# Altium schematic sheet DAC_ADC.SchDoc
size A4; Revision: 1; SheetNumber: 1; SheetTotal: 5
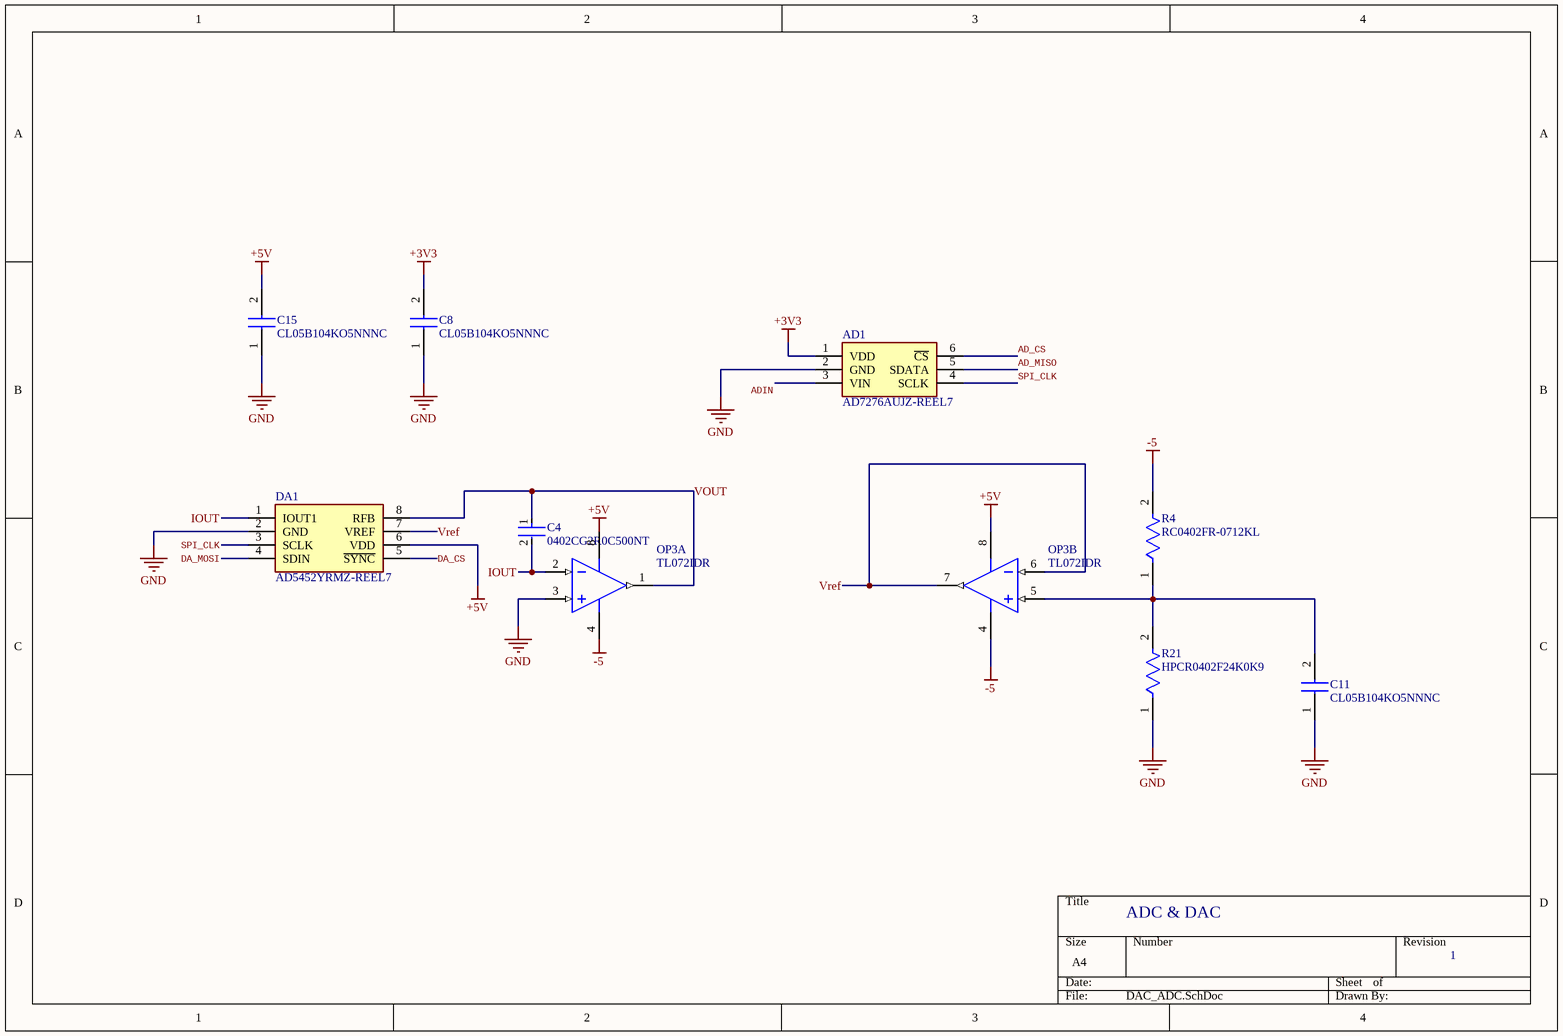
[diagram p0: DAC_ADC.SchDoc]

## Parts
AD1  AD7276AUJZ-REEL7  [SOT95P280X100-6N]
C4  0402CG2R0C500NT  [FP-GJM155-0_05-IPC_C]
C8  CL05B104KO5NNNC  [CAPC1005X55N]
C11  CL05B104KO5NNNC  [CAPC1005X55N]
C15  CL05B104KO5NNNC  [CAPC1005X55N]
DA1  AD5452YRMZ-REEL7  [SOP65P490X110-8N]
OP3  TL072IDR  [D0008A_L]  (parts A,B of 2)
R4  RC0402FR-0712KL  [FP-RC0402-0_4-IPC_C]
R21  HPCR0402F24K0K9  [FP-RT0402-MFG]

## Nets
+3V3: AD1.1(VDD) C8.2
+5V: C15.2 DA1.6(VDD) OP3.8(VCC+)
-5: OP3.4(VCC-) R4.2
GND: AD1.2(GND) C8.1 C11.1 C15.1 DA1.2(GND) OP3.3(IN1+) R21.1
AD_CS: AD1.6(~{CS})
AD_MISO: AD1.5(SDATA)
ADIN: AD1.3(VIN)
DA_CS: DA1.5(~{SYNC})
DA_MOSI: DA1.4(SDIN)
IOUT: C4.2 DA1.1(IOUT1) OP3.2(IN1-)
SPI_CLK: AD1.4(SCLK) DA1.3(SCLK)
VOUT: C4.1 DA1.8(RFB) OP3.1(OUT1)
Vref: DA1.7(VREF) OP3.6(IN2-) OP3.7(OUT2)
NetC11_2: C11.2 OP3.5(IN2+) R4.1 R21.2

## Notes on the sheet
- ADC & DAC
- 1

## Library data of the parts
AD1 = AD7276AUJZ-REEL7: Integrated Circuit; Manufacturer_Name: Analog Devices; Datasheet Link: http://componentsearchengine.com/Datasheets/1/AD7276AUJZ-REEL7.pdf; Height: 1mm; Manufacturer_Part_Number: AD7276AUJZ-REEL7; Mouser Part Number: 584-AD7276AUJZ-R7; Mouser Price/Stock: https://www.mouser.co.uk/ProductDetail/Analog-Devices/AD7276AUJZ-REEL7?qs=NmRFExCfTkGcJMyUALbIIQ%3D%3D; Arrow Part Number: AD7276AUJZ-REEL7; Arrow Price/Stock: https://www.arrow.com/en/products/ad7276aujz-reel7/analog-devices
C4 = CMP-2008-03830-2: Multi-Layer Ceramic Capacitor 2pF C0G  ±0.1pF 0402 Paper T/R; Voltage Rating: 50V; Mount: Surface Mount; REACH SVHC: No SVHC; Lead Pitch: 0.3mm; Length: 1mm; Lead Free: Lead Free; Radiation Hardening: No; Depth: 0.5mm; Thickness: 0.022inch; Number of Pins: 2; Height: 0.5mm; Min Operating Temperature: -55°C; Width: 0.5mm; Packaging: Tape and Reel; Case Code (Metric): 1005; Capacitance: 2pF; Voltage Rating (DC): 50V; Package Quantity: 1; Max Operating Temperature: 125°C; Case/Package: 0402; Case Code (Imperial): 0402; Dielectric: C0G; Termination: SMD/SMT
C8 C11 C15 = CL05B104KO5NNNC: Capacitor; Manufacturer_Name: SAMSUNG; Datasheet Link: https://datasheet.datasheetarchive.com/originals/distributors/Datasheets-DGA10/2408147.pdf; Height: 0.55mm; Manufacturer_Part_Number: CL05B104KO5NNNC; Mouser Part Number: 187-CL05B104KO5NNNC; Mouser Price/Stock: https://www.mouser.co.uk/ProductDetail/Samsung-Electro-Mechanics/CL05B104KO5NNNC?qs=hqM3L16%252BxlfT2SKOuAUq6Q%3D%3D; Arrow Part Number: CL05B104KO5NNNC; Arrow Price/Stock: https://www.arrow.com/en/products/cl05b104ko5nnnc/samsung-electro-mechanics?utm_currency=USD&region=europe
DA1 = AD5452YRMZ-REEL7: Integrated Circuit; Manufacturer_Name: Analog Devices; Datasheet Link: https://componentsearchengine.com/Datasheets/1/AD5452YRMZ-REEL7.pdf; Height: 1.1mm; Manufacturer_Part_Number: AD5452YRMZ-REEL7; Mouser Part Number: 584-AD5452YRMZ-R7; Mouser Price/Stock: https://www.mouser.co.uk/ProductDetail/Analog-Devices/AD5452YRMZ-REEL7?qs=NmRFExCfTkHoityukWLALQ%3D%3D; Arrow Part Number: AD5452YRMZ-REEL7; Arrow Price/Stock: https://www.arrow.com/en/products/ad5452yrmz-reel7/analog-devices?region=nac
OP3 = CMP-0015-00084-2: Dual Low-Noise JFET-Input General-Purpose Operational Amplifier, 7 to 36 V, -40 to 85 degC, 8-pin SOIC (D8), Green (RoHS & no Sb/Br); Manufacturer: Texas Instruments; Number of Channels: 2; Rating: Catalog; IIB(Max)(pA): 200; Total Supply Voltage(Max)(+5V is 5, +/-5V is 10): 36; Vio (25C)(Max)(mV): 6; Iq per channel(Max)(mA): 2.5; Offset Drift(Typ)(uV/C): 18; Total Supply Voltage(Min)(+5V is 5, +/-5V is 10): 7; CMRR(Min)(dB): 75; Slew Rate(Typ)(V/us): 13; Sub Family: General Purpose Amplifier, High Supply Voltage Amplifier (>=30V); GBW(Typ)(MHz): 3; Code_JEDEC: MS-012; Eco-Plan: Green (RoHS & no Sb/Br); Mounting Technology: Surface Mount; ComponentLink3Description: Package Specification; PackageReference: D0008A; ComponentLink2URL: http://www.ti.com/lit/ds/symlink/tl072.pdf; ComponentLink1Description: Manufacturer URL; ComponentLink3URL: http://www.ti.com/litv/pdf/msoi002j; ComponentLink2Description: Datasheet; DatasheetVersion: SLOS080J; ComponentLink1URL: http://www.ti.com/; PackageDescription: 8-Pin Plastic Small Outline, Body 4.9 x 3.9 mm, Pitch 1.27 mm; PackageVersion: 4040047-3/M, 06/2011; Vn at 1kHz(Typ)(nV/rtHz): 18; PartNumber: TL072IDR
R4 = CMP-2002-07378-2: RES SMD 12K OHM 1% 1/16W 0402; Power Rating: 62.5mW; Voltage Rating: 50V; Resistance: 12kR; Max Power Dissipation: 63mW; Temperature Coefficient: 100ppm/°C; Construction: Rectangular; Case Code (Metric): 1005; Package Quantity: 1; Weight: 2.3E-05oz; RoHS Compliant: Yes; Packaging: Tape and Reel; Case Code (Imperial): 0402; Military Standard: Not; Min Operating Temperature: -55°C; Depth: 0.5mm; Length: 1mm; Width: 0.02inch; Termination: SMD/SMT; Lead Free: Lead Free; Tolerance: 1%; REACH SVHC: No SVHC; Size Code: 0402; Resistance Tolerance: 1%; Series: RC; Max Operating Temperature: 155°C; Height: 0.016inch; Features: Moisture Resistant; Number of Terminations: 2; Case/Package: 0402; Resistor Type: Thick Film
R21 = CMP-03412-008661-1: RES SMD 12K OHM 1% 1/16W 0402; Manufacturer: Yageo; Temperature Coefficient: 50 ppm/°C; Voltage Rating: 50V; Tolerance: 0.01; Power Rating: 0.063W; Resistance: 24KΩ; Value: 12KΩ; ComponentLink2Description: Datasheet; Height: 0.35mm; Lead Free: Yes; Package: RT0402; Series: RT; RoHS: TRUE; Manufacturer Part Number: HPCR0402F24K0K9; ComponentLink2URL: http://www.yageo.com/documents/recent/PYu-RT_1-to-0.01_RoHS_L_9.pdf; Temperature Range Low: -55°C; Device Class L1: Passive Components; Temperature Range High: +155°C; Automotive: No; Digikey Description: RES SMD 14K OHM 1% 1/16W 0402; Ipc Land Pattern Name: RESC10050X30; Octopart: https://octopart.com/rt0402fre0714kl-yageo-1378200; Category: Res; Temperature: -55°C to +155°C; Footprint Url: http://www.yageo.com/exep/pages/download/literatures/PYu-R_Mount_10.pdf; Device Class L3: Chip SMD Resistors; Composition: Thin Film; Device Class L2: Resistors